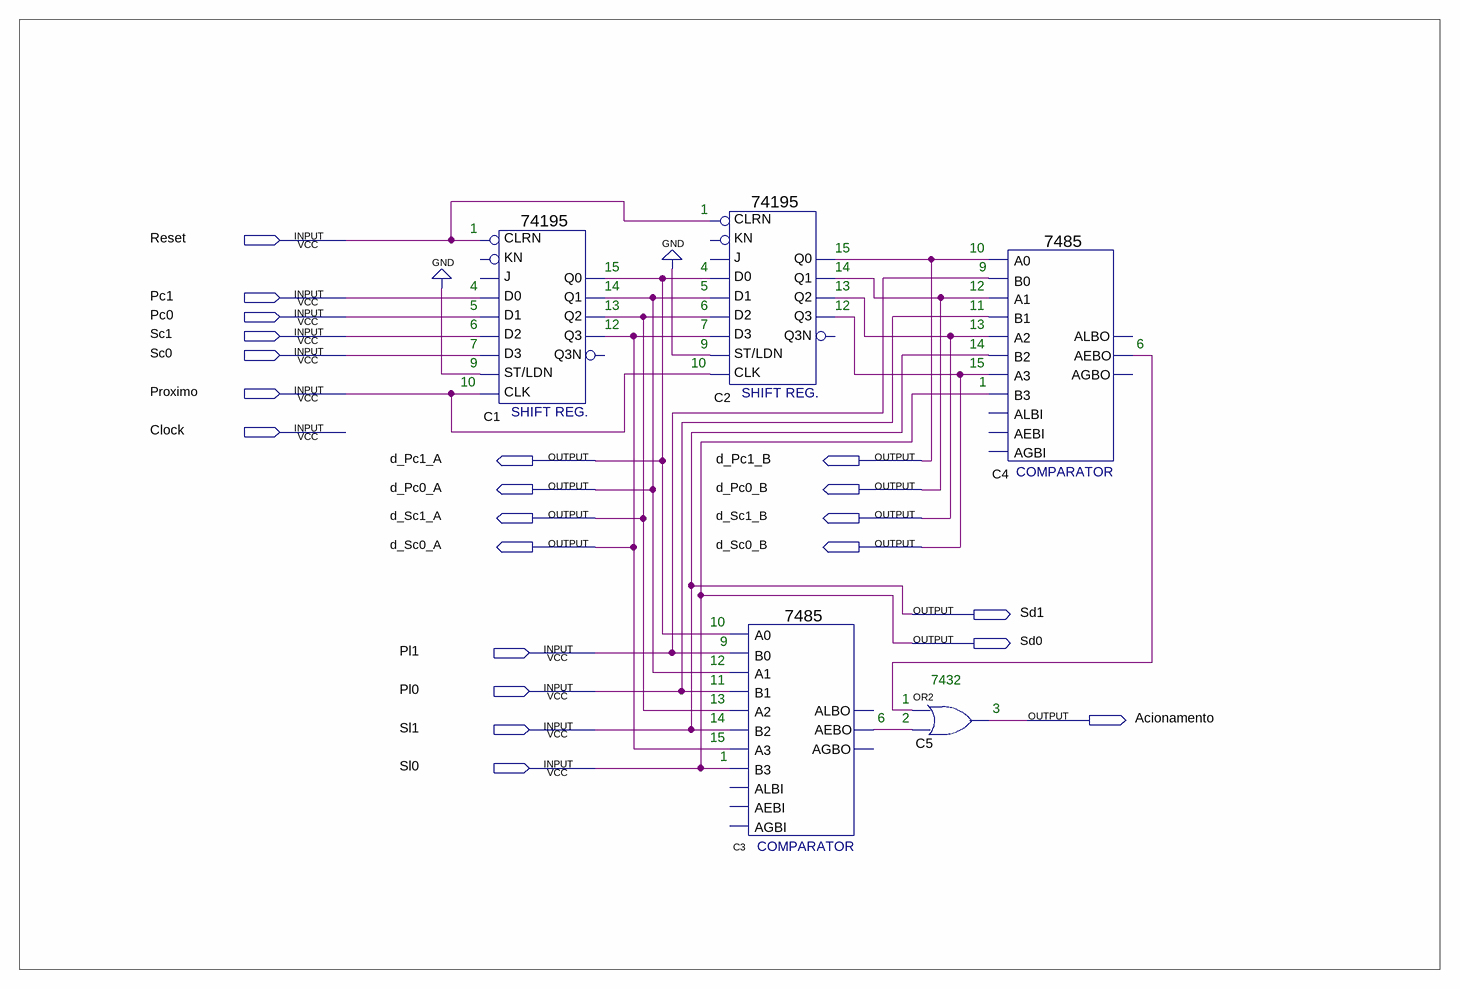
[diagram p0: schematic sheet]
// Quartus schematic Exp07.bdf as structural Verilog: 5 symbols, 22 pins
module Exp07 (
  input  Reset,
  input  Pc1,
  input  Pc0,
  input  Sc1,
  input  Sc0,
  input  Proximo,
  input  Clock,
  input  Pl1,
  input  Pl0,
  input  Sl1,
  input  Sl0,
  output d_Pc1_A,
  output d_Pc1_B,
  output d_Pc0_A,
  output d_Pc0_B,
  output d_Sc1_A,
  output d_Sc1_B,
  output d_Sc0_A,
  output d_Sc0_B,
  output Sd1,
  output Sd0,
  output Acionamento
);

  wire C3_aebo, C4_aebo;

  \74195  C1 (
    .\ST/LDN (1'b0), .CLRN(Reset), .D2(Sc1), .D1(Pc0), .D0(Pc1), .CLK(Proximo), .D3(Sc0), .Q3(d_Sc0_A),
    .Q0(d_Pc1_A), .Q1(d_Pc0_A), .Q2(d_Sc1_A));  // open: KN, J, Q3N
  \74195  C2 (
    .\ST/LDN (1'b0), .CLRN(Reset), .D2(d_Sc1_A), .D1(d_Pc0_A), .D0(d_Pc1_A), .CLK(Proximo), .D3(d_Sc0_A),
    .Q3(d_Sc0_B), .Q0(d_Pc1_B), .Q1(d_Pc0_B), .Q2(d_Sc1_B));  // open: KN, J, Q3N
  \7485  C3 (
    .A3(d_Sc0_A), .B2(Sl1), .A2(d_Sc1_A), .A0(d_Pc1_A), .B0(Pl1), .B3(Sl0), .A1(d_Pc0_A), .B1(Pl0),
    .AEBO(C3_aebo));  // open: AEBI, AGBI, ALBI, ALBO, AGBO
  or C5 (Acionamento, C4_aebo, C3_aebo);
  \7485  C4 (
    .A3(d_Sc0_B), .B2(Sl1), .A2(d_Sc1_B), .A0(d_Pc1_B), .B0(Pl1), .B3(Sl0), .A1(d_Pc0_B), .B1(Pl0),
    .AEBO(C4_aebo));  // open: AEBI, AGBI, ALBI, ALBO, AGBO

  assign Sd0 = Sl0;
  assign Sd1 = Sl1;

  // Notes on the sheet:
  //   1
  //   1
  //   15
  //   10
  //   15
  //   4
  //   14
  //   9
  //   4
  //   14
  //   5
  //   13
  //   12
  //   5
  //   13
  //   6
  //   12
  //   11
  //   6
  //   12
  //   7
  //   13
  //   7
  //   9
  //   14
  //    6
  //   9
  //   10
  //   15
  //   10
  //   1
  //   10
  //   9
  //   12
  //   11
  //   7432
  //   13
  //   1
  //    3
  //   14
  //    6
  //   2
  //   15
  //   1
endmodule
